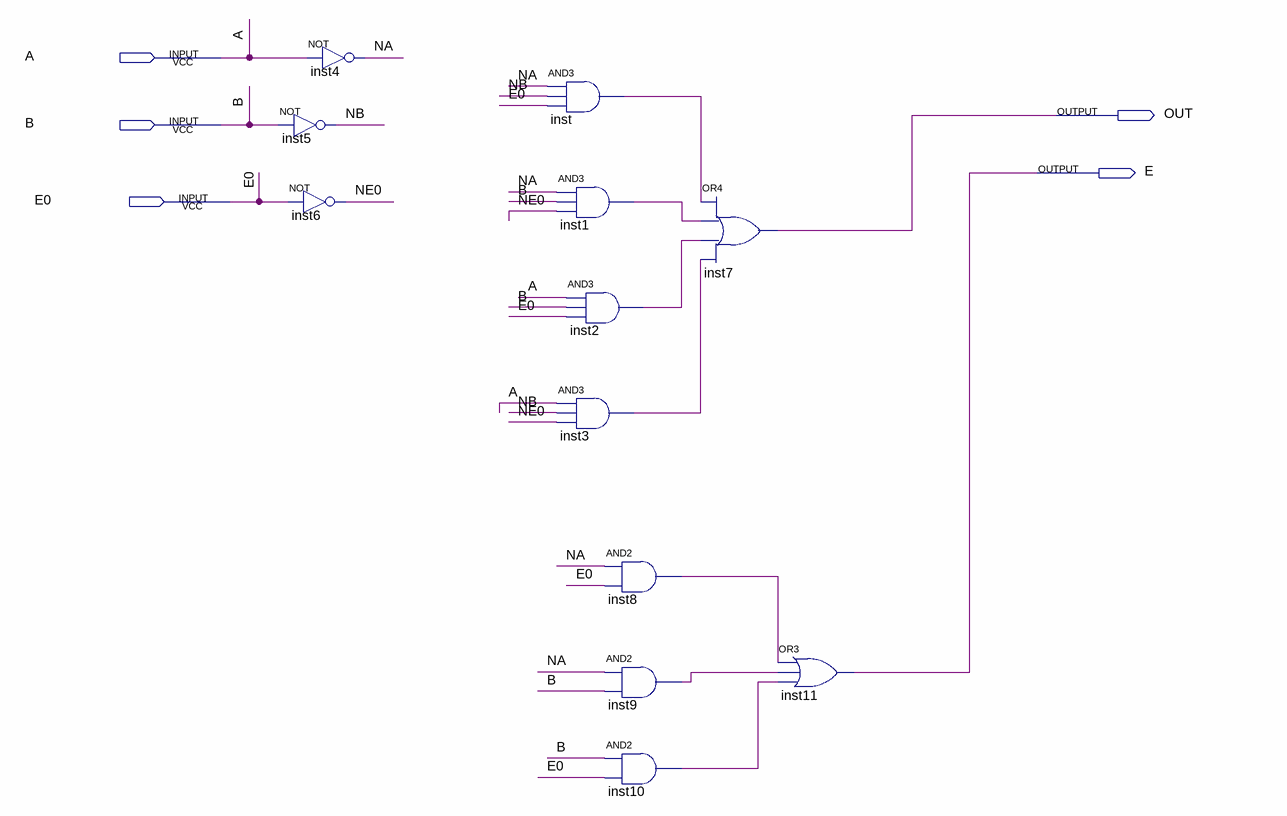
[diagram p0: schematic sheet]
// Quartus schematic SUB1.bdf as structural Verilog: 12 symbols, 5 pins
module SUB1 (
  input  A,
  input  B,
  input  E0,
  output OUT,
  output E
);

  wire inst1_out, inst2_out, inst3_out, inst8_out, inst9_out, inst10_out, inst_out, NA, NB, NE0;

  not inst5 (NB, B);
  not inst4 (NA, A);
  not inst6 (NE0, E0);
  and inst (inst_out, NA, NB, E0);
  and inst1 (inst1_out, NA, B, NE0);
  and inst2 (inst2_out, A, B, E0);
  and inst3 (inst3_out, A, NB, NE0);
  and inst8 (inst8_out, NA, E0);
  and inst9 (inst9_out, NA, B);
  and inst10 (inst10_out, B, E0);
  or inst7 (OUT, inst_out, inst1_out, inst2_out, inst3_out);
  or inst11 (E, inst8_out, inst9_out, inst10_out);
endmodule
